# EasyEDA Pro project meteo_station_main.eprj

# Schematic Schematic1
Board Name: Board1; Create Date: 2026-02-01; Page Name: P1; Project Name: meteo_station_main; Schematic Name: Schematic1; Update Date: 2026-02-01; Company: EasyEDA.com; Page Size: A4; Version: V1.0
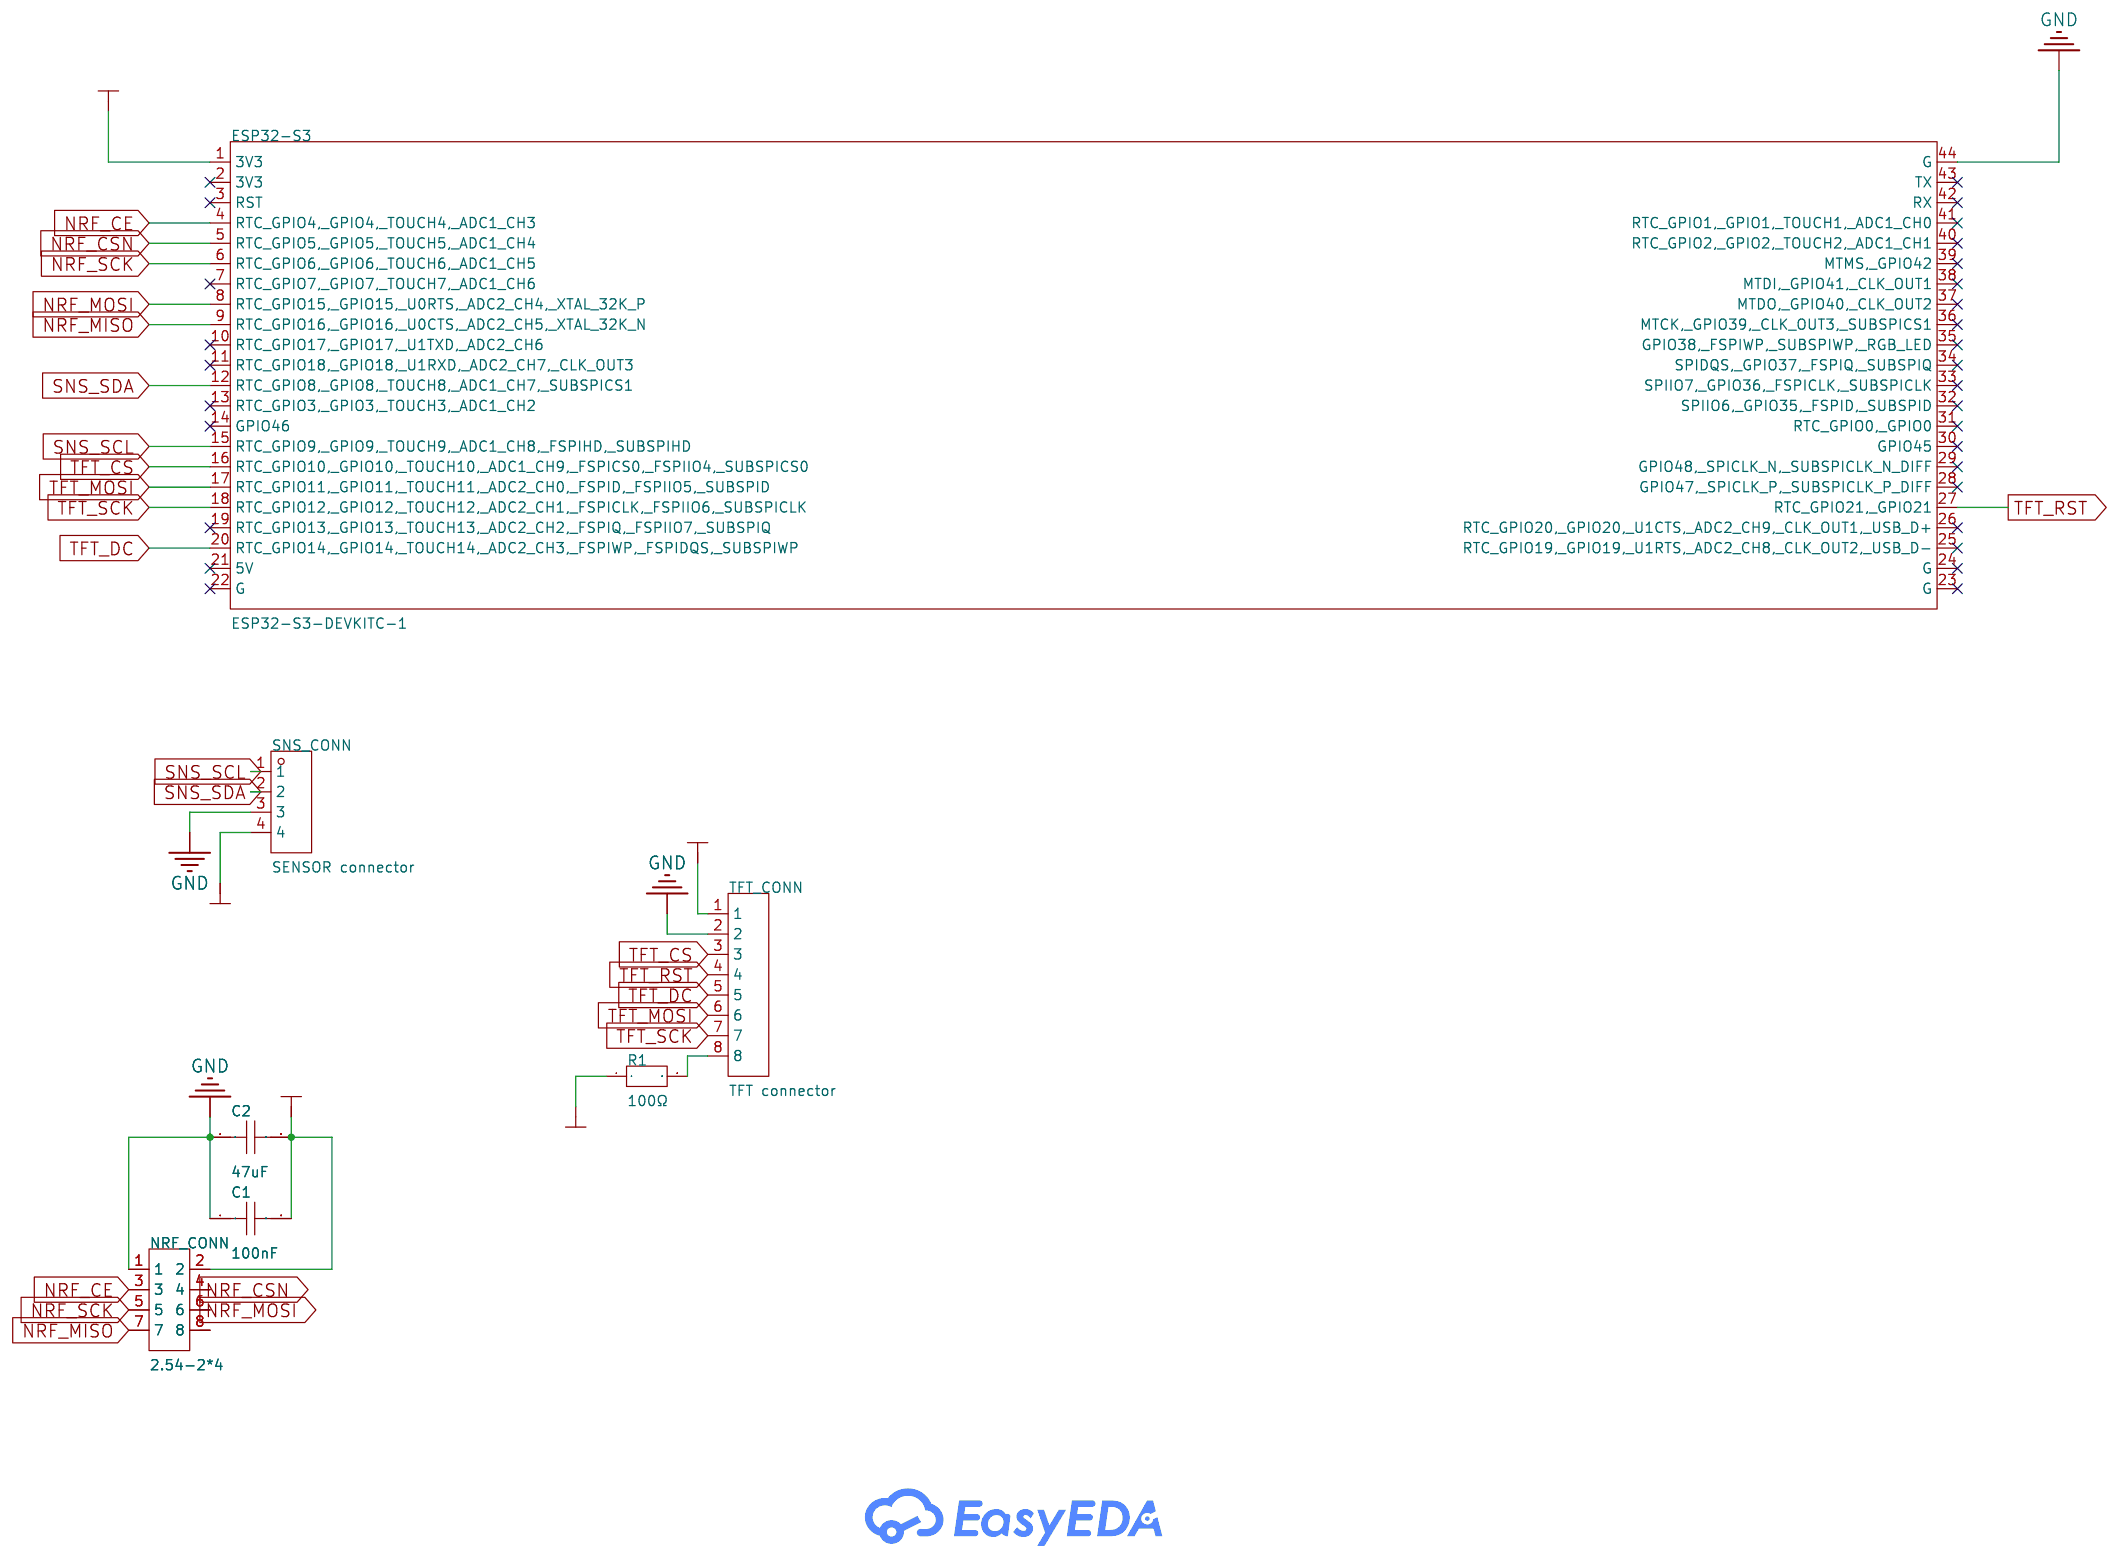
[diagram p0: schematic sheet]

## Parts
C1  100nF  [CAP-TH_L5.5-W2.4-P5.08-D0.6]
C2  47uF  [CAP-TH_L5.5-W2.4-P5.08-D0.6]
ESP32-S3  ESP32-S3-DEVKITC-1  [COMM-TH_ESP32-S3-DEVKITC-N16R8]
NRF_CONN  2.54-2*4  [HDR-TH_8P-P2.54-V-F-R2-C4-S2.54]
R1  100Ω  [RES-TH_BD5.6-L14.0-P18.00-D0.8]
SNS_CONN  SENSOR connector  [HDR-TH_4P-P2.54-V-M-3]
TFT_CONN  TFT connector  [CONN-TH_8P-P2.54_XH2.54_C9900012080]

## Library data of the parts
C1 C2 = CC1H104ZC1ED3F5O1100: Capacitance:100nF Tolerance:-20%~+80% Tolerance:-20%~+80% Voltage Rating:50V Pin Spacing:5.08mm Temperature Coefficient:Y5V Diameter:5.5mm Body Thickness:2.4mm; LCSC Part Name: 100nF -20%~+80% 50V; Supplier Part: C2832507; Manufacturer: Dersonic(德尔创); Supplier Footprint: 插件,P=5.08mm; JLCPCB Part Class: Extended Part; Datasheet: https://item.szlcsc.com/datasheet/CC1H104ZC1ED3F5O1100/2990645.html; Supplier: LCSC; Tolerance: -20%~+80%; Voltage Rating: 50V; Pin Spacing: 5.08mm; Temperature Coefficient: Y5V; Diameter: 5.5mm; Body Thickness: 2.4mm
ESP32-S3 = ESP32-S3-DEVKITC-1-N8: Supplier Part: C20438410; Manufacturer: ESPRESSIF(乐鑫); JLCPCB Part Class: Extended Part; Supplier: LCSC
NRF_CONN = 2.54-2*4: Holes Structure:2x4P Pitch:2.54mm Row Spacing:2.54mm Circular Hole / Square Hole:Square Hole Mounting Type:Through Hole Number of Rows:2 Number of Positions:8P Current Rating:2.5A Voltage Rating (Max):- Holes Direction:Top Insulation Height:8.5mm Operatin; LCSC Part Name: 间距:2.54mm 2x4P 直插; Supplier Part: C2977588; Manufacturer: ZHOURI(洲日); Supplier Footprint: 插件,P=2.54mm; JLCPCB Part Class: Extended Part; Datasheet: https://item.szlcsc.com/datasheet/2.54-2*4/3388940.html; Supplier: LCSC; Holes Structure: 2x4P; Pitch: 2.54mm; Row Spacing: 2.54mm; Circular Hole / Square Hole: Square Hole; Mounting Type: Through Hole; Number of Rows: 2; Number of Positions: 8P; Current Rating: 2.5A; Holes Direction: Top; Insulation Height: 8.5mm; Operating Temperature: -40℃~+105℃
R1 = RLP03100R0FB15: Resistance: Tolerance:±1% Tolerance:±1%; LCSC Part Name: 100Ω ±1%; Supplier Part: C3429629; Manufacturer: VISHAY(威世); JLCPCB Part Class: Extended Part; Supplier: LCSC; Tolerance: ±1%
SNS_CONN = SIP4-CON4排针: Supplier Part: C9900002129; Supplier Footprint: SIP-4_2.54X10.16X2.54P; JLCPCB Part Class: Extended Part; Supplier: LCSC
TFT_CONN = XH2.54-8PIN: Supplier Part: C9900014929; Supplier Footprint: JP8; JLCPCB Part Class: Extended Part; Supplier: LCSC

## Nets
GND: C1.1 C2.1 ESP32-S3.44(G) NRF_CONN.1 SNS_CONN.3 TFT_CONN.2
VCC_3V3: C1.2 C2.2 ESP32-S3.1(3V3) NRF_CONN.2 R1.1 SNS_CONN.4 TFT_CONN.1
NRF_CE: ESP32-S3.4(RTC_GPIO4, GPIO4, TOUCH4, ADC1_CH3) NRF_CONN.3
NRF_CSN: ESP32-S3.5(RTC_GPIO5, GPIO5, TOUCH5, ADC1_CH4) NRF_CONN.4
NRF_MISO: ESP32-S3.9(RTC_GPIO16, GPIO16, U0CTS, ADC2_CH5, XTAL_32K_N) NRF_CONN.7
NRF_MOSI: ESP32-S3.8(RTC_GPIO15, GPIO15, U0RTS, ADC2_CH4, XTAL_32K_P) NRF_CONN.6
NRF_SCK: ESP32-S3.6(RTC_GPIO6, GPIO6, TOUCH6, ADC1_CH5) NRF_CONN.5
SNS_SCL: ESP32-S3.15(RTC_GPIO9, GPIO9, TOUCH9, ADC1_CH8, FSPIHD, SUBSPIHD) SNS_CONN.1
SNS_SDA: ESP32-S3.12(RTC_GPIO8, GPIO8, TOUCH8, ADC1_CH7, SUBSPICS1) SNS_CONN.2
TFT_CS: ESP32-S3.16(RTC_GPIO10, GPIO10, TOUCH10, ADC1_CH9, FSPICS0, FSPIIO4, SUBSPICS0) TFT_CONN.3
TFT_DC: ESP32-S3.20(RTC_GPIO14, GPIO14, TOUCH14, ADC2_CH3, FSPIWP, FSPIDQS, SUBSPIWP) TFT_CONN.5
TFT_MOSI: ESP32-S3.17(RTC_GPIO11, GPIO11, TOUCH11, ADC2_CH0, FSPID, FSPIIO5, SUBSPID) TFT_CONN.6
TFT_RST: ESP32-S3.27(RTC_GPIO21, GPIO21) TFT_CONN.4
TFT_SCK: ESP32-S3.18(RTC_GPIO12, GPIO12, TOUCH12, ADC2_CH1, FSPICLK, FSPIIO6, SUBSPICLK) TFT_CONN.7
$1N883: R1.2 TFT_CONN.8

Not connected (* = marked no-connect by the designer): ESP32-S3 2(3V3)* 3(RST)* 7(RTC_GPIO7, GPIO7, TOUCH7, ADC1_CH6)* 10(RTC_GPIO17, GPIO17, U1TXD, ADC2_CH6)* 11(RTC_GPIO18, GPIO18, U1RXD, ADC2_CH7, CLK_OUT3)* 13(RTC_GPIO3, GPIO3, TOUCH3, ADC1_CH2)* 14(GPIO46)* 19(RTC_GPIO13, GPIO13, TOUCH13, ADC2_CH2, FSPIQ, FSPIIO7, SUBSPIQ)* 21(5V)* 22(G)* 23(G)* 24(G)* 25(RTC_GPIO19, GPIO19, U1RTS, ADC2_CH8, CLK_OUT2, USB_D-)* 26(RTC_GPIO20, GPIO20, U1CTS, ADC2_CH9, CLK_OUT1, USB_D+)* 28(GPIO47, SPICLK_P, SUBSPICLK_P_DIFF)* 29(GPIO48, SPICLK_N, SUBSPICLK_N_DIFF)* 30(GPIO45)* 31(RTC_GPIO0, GPIO0)* 32(SPIIO6, GPIO35, FSPID, SUBSPID)* 33(SPIIO7, GPIO36, FSPICLK, SUBSPICLK)* 34(SPIDQS, GPIO37, FSPIQ, SUBSPIQ)* 35(GPIO38, FSPIWP, SUBSPIWP, RGB LED)* 36(MTCK, GPIO39, CLK_OUT3, SUBSPICS1)* 37(MTDO, GPIO40, CLK_OUT2)* 38(MTDI, GPIO41, CLK_OUT1)* 39(MTMS, GPIO42)* 40(RTC_GPIO2, GPIO2, TOUCH2, ADC1_CH1)* 41(RTC_GPIO1, GPIO1, TOUCH1, ADC1_CH0)* 42(RX)* 43(TX)*; NRF_CONN 8

# Board PCB1
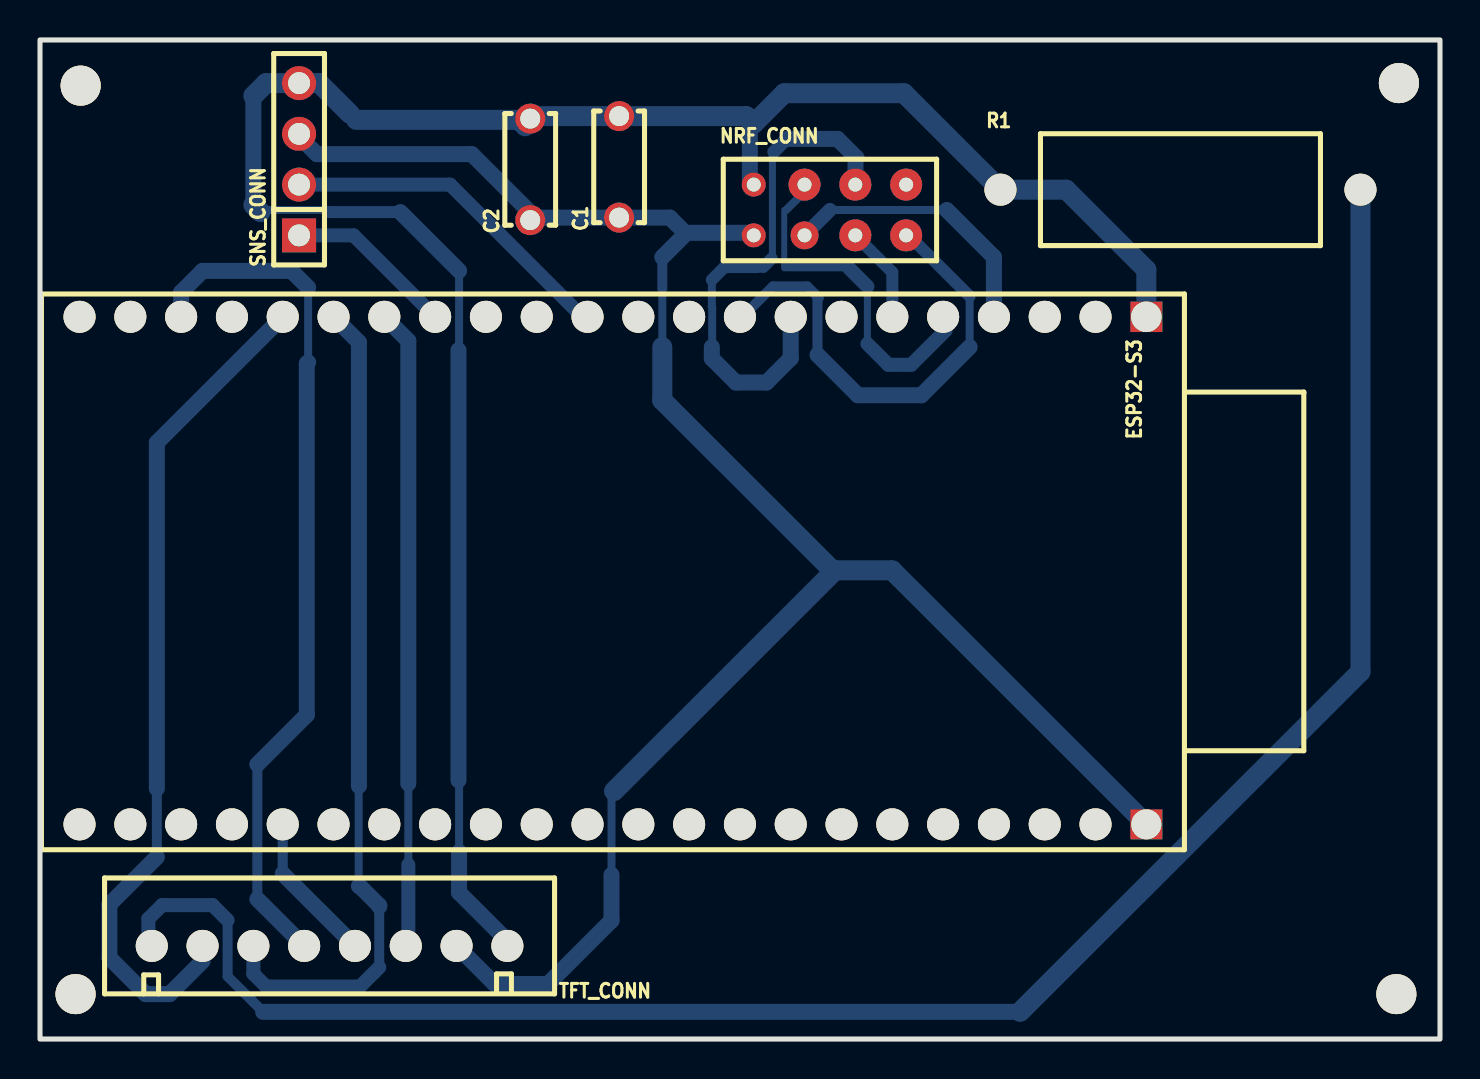
[diagram p1: board, top side]
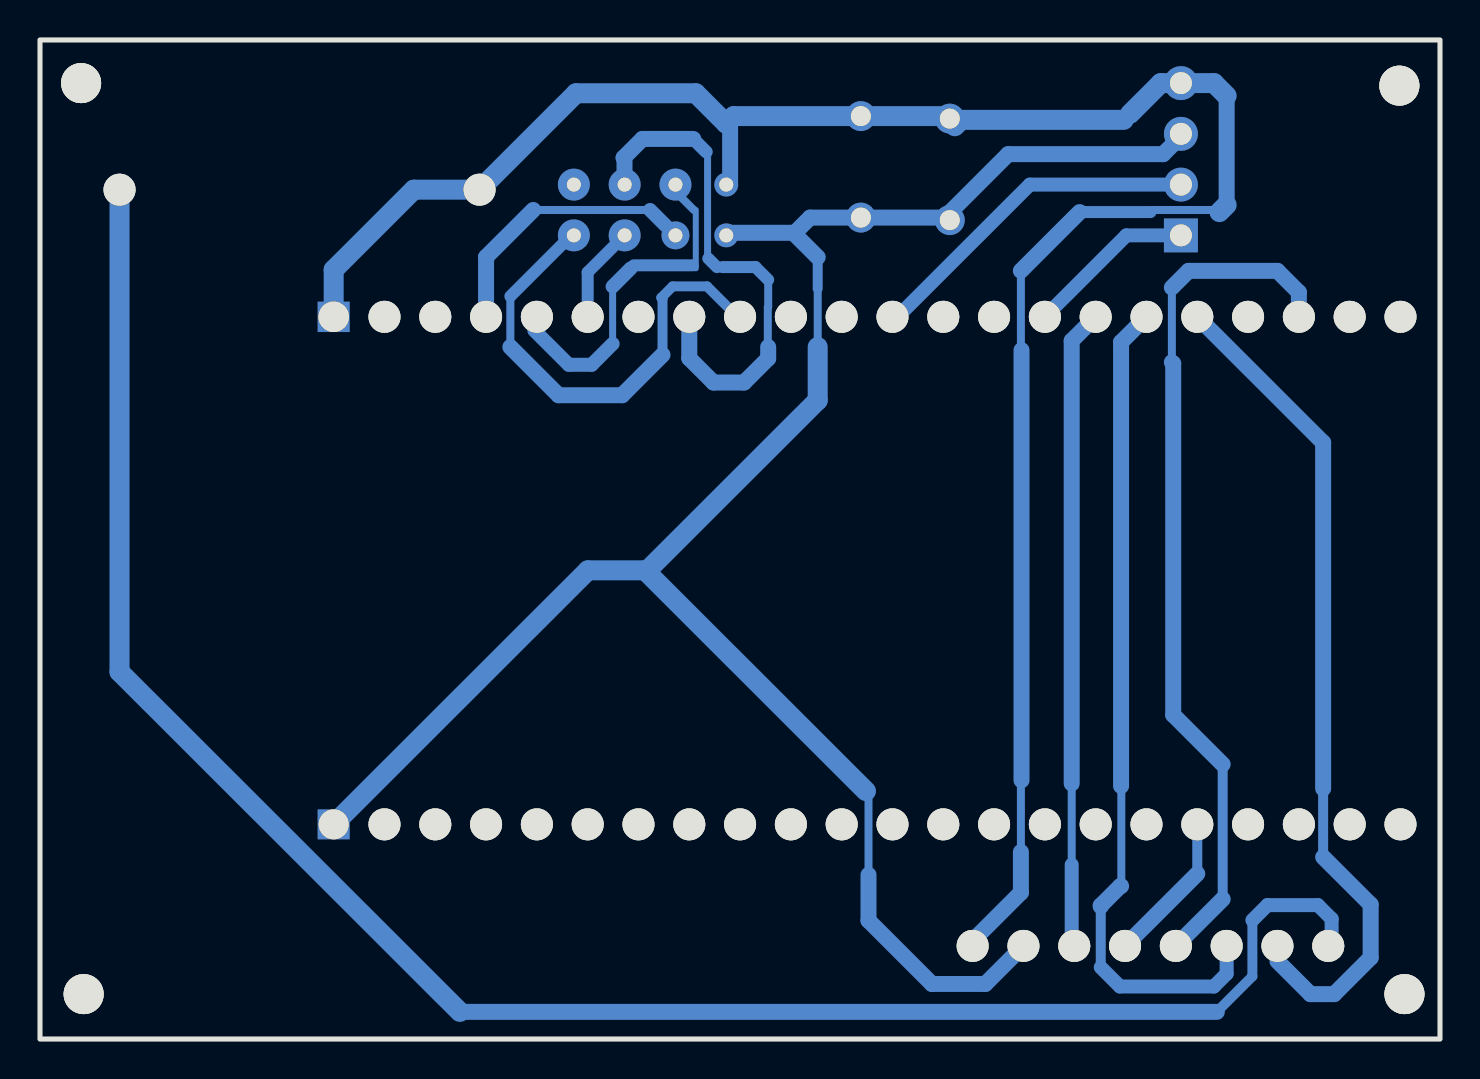
[diagram p2: board, bottom side, seen from below]

Outline 70 x 50 mm; copper layers: Top Layer, Bottom Layer. Coordinates in mm from the lower left corner of the outline.
Outline path: rectangle 0,50 70,0
Stack: Top Layer 0.035mm / Dielectric1 1.51mm FR4 er 4.5 / Bottom Layer 0.035mm

## Design rules (mm)
template: JLCPCB Capability(Two Layers Board)
spacing copperThickness1oz (default): track to track 0.102, other pairs 0.152 to 0.3
spacing copperThickness2oz: track to track 0.203, other pairs 0.152 to 0.3
track width copperThickness1oz (default): min 0.127, default 0.254, max 2.54
track width copperThickness2oz: min 0.203, default 0.254, max 2.54
differential pair differentialPair (default): width min 0.127, default 0.254, max 2.54; gap min 0.152, default 0.152
via viaSize (default): diameter min 0.5, default 0.61, max 10; hole min 0.3, default 0.305, max 6.3

## Placement (name value [footprint] x y rotation side)
C1  100nF  [CAP-TH_L5.5-W2.4-P5.08-D0.6]  28.96 43.65 90 top
C2  47uF  [CAP-TH_L5.5-W2.4-P5.08-D0.6]  24.51 43.52 90 top
ESP32-S3  ESP32-S3-DEVKITC-1  [COMM-TH_ESP32-S3-DEVKITC-N16R8]  28.65 23.44 270 top
NOREF  -  [Pad_e24]  67.82 2.25 0 top
NOREF#2  -  [Pad_e8608]  67.95 47.84 0 top
NOREF#3  -  [Pad_e439]  1.78 2.25 0 top
NOREF#4  -  [Pad_e19]  2.03 47.71 0 top
NRF_CONN  2.54-2*4  [HDR-TH_8P-P2.54-V-F-R2-C4-S2.54]  39.5 41.49 0 top
R1  100Ω  [RES-TH_BD5.6-L14.0-P18.00-D0.8]  57.02 42.51 0 top
SNS_CONN  SENSOR connector  [HDR-TH_4P-P2.54-V-M-3]  12.95 44.03 90 top
TFT_CONN  TFT connector  [CONN-TH_8P-P2.54_XH2.54_C9900012080]  14.48 4.66 180 top

## Footprints (pads in the part's own frame, mm; a bottom-side part is the same pattern mirrored in y, then rotated)
CAP-TH_L5.5-W2.4-P5.08-D0.6
  round 1.5 hole 1x0.8: 1(-2.54,0) 2(2.54,0)
COMM-TH_ESP32-S3-DEVKITC-N16R8
  rect 1.524x1.6 hole 1.6x0.8: 1(-12.7,26.67)
  round 1.6 hole 1.6x0.8: 2(-12.7,24.13) 3(-12.7,21.59) 4(-12.7,19.05) 5(-12.7,16.51) 6(-12.7,13.97) 7(-12.7,11.43) 8(-12.7,8.89) 9(-12.7,6.35) 10(-12.7,3.81) 11(-12.7,1.27) 12(-12.7,-1.27) 13(-12.7,-3.81) 14(-12.7,-6.35) 15(-12.7,-8.89) 16(-12.7,-11.43) 17(-12.7,-13.97) 18(-12.7,-16.51) 19(-12.7,-19.05) 20(-12.7,-21.59) 21(-12.7,-24.13) 22(-12.7,-26.67) 23(12.7,-26.67) 24(12.7,-24.13) 25(12.7,-21.59) 26(12.7,-19.05) 27(12.7,-16.51) 28(12.7,-13.97) 29(12.7,-11.43) 30(12.7,-8.89) 31(12.7,-6.35) 32(12.7,-3.81) 33(12.7,-1.27) 34(12.7,1.27) 35(12.7,3.81) 36(12.7,6.35) 37(12.7,8.89) 38(12.7,11.43) 39(12.7,13.97) 40(12.7,16.51) 41(12.7,19.05) 42(12.7,21.59) 43(12.7,24.13)
  rect 1.5x1.6 hole 1.6x0.8: 44(12.7,26.67)
CONN-TH_8P-P2.54_XH2.54_C9900012080
  round 1.6 hole 1.6x0.8: 1(-8.89,0) 2(-6.35,0) 3(-3.81,0) 4(-1.27,0) 5(1.27,0) 6(3.81,0) 7(6.35,0) 8(8.89,0)
HDR-TH_4P-P2.54-V-M-3
  rect 1.7x1.7 hole 1.1x0.8: 1(-3.81,0)
  round 1.7 hole 1.1x0.8: 2(-1.27,0) 3(1.27,0) 4(3.81,0)
HDR-TH_8P-P2.54-V-F-R2-C4-S2.54
  round 1.2 hole 0.7: 1(-3.81,-1.27) 2(-3.81,1.27)
  round 1.4 hole 0.7: 3(-1.27,-1.27)
  round 1.6 hole 0.7: 4(-1.27,1.27) 5(1.27,-1.27) 6(1.27,1.27) 7(3.81,-1.27) 8(3.81,1.27)
Pad_e19
  round 2 hole 4x2: 1(0,0)
Pad_e24
  round 2 hole 4x2: 2(0,0)
Pad_e439
  round 2 hole 4x2: 2(0,0)
Pad_e8608
  round 2 hole 4x2: 2(0,0)
RES-TH_BD5.6-L14.0-P18.00-D0.8
  round 1.6 hole 1.6x0.8: 1(-9,0) 2(9,0)

## Nets
As in the schematic.

Pads without a net: ESP32-S3 2 3 7 10 11 13 14 19 21 22 23 24 25 26 28 29 30 31 32 33 34 35 36 37 38 39 40 41 42 43; NOREF 2; NOREF#2 2; NOREF#3 2; NOREF#4 1

## Routing (per net, layer and track width the routed paths; a pad name or vN(x,y) marks a point on that pad's centre or on a via; arc(x,y) is an arc through that point)
GND: length 98.7
  Bottom Layer w0.4: 31.11,37.55 31.11,34.63 ; 28.58,8.22 28.58,12.28
  Bottom Layer w0.5: 31.11,39.13 31.11,37.55
  Bottom Layer w0.8: SNS_CONN.3 12.95,45.17 13.84,44.28 21.59,44.28 24.51,41.36 C2.1 24.64,41.11 C1.1 31.5,41.11 32.26,40.35 ; 28.58,8.22 28.58,5.93 25.4,2.76 22.73,2.76 TFT_CONN.2 ; 31.11,39.13 32.33,40.35 35.56,40.35 NRF_CONN.1
  Bottom Layer w1: ESP32-S3.44 42.6,23.46 39.75,23.46 28.7,12.41 ; 31.11,34.63 31.11,31.97 39.62,23.46
VCC_3V3: length 107.7
  Bottom Layer w0.4: 20.95,12.92 20.95,9.36 ; 14.48,41.39 14.37,41.49 11.13,41.49 11.03,41.39 ; 20.95,38.45 20.95,34.51
  Bottom Layer w0.5: 35.49,42.95 35.69,42.76 ; 20.92,12.95 20.95,12.92 ; 35.69,45.81 35.49,45.61 ; 20.95,34.51 20.92,34.48
  Bottom Layer w0.6: 14.48,41.39 18.02,41.39
  Bottom Layer w0.7: 23.37,4.91 TFT_CONN.1
  Bottom Layer w0.8: 10.67,47.21 10.67,41.74 ; 35.49,45.61 35.49,42.95 ; 20.92,34.48 20.92,12.95 ; 20.95,38.45 18.02,41.39 ; 20.95,9.36 20.95,7.33 23.37,4.91 ; 24.51,46.06 24.51,45.94 24.26,45.68
  Bottom Layer w1: 24.26,45.68 23.94,46 15.81,46 ; 10.67,41.74 11.03,41.39 ; 24.51,46.06 24.64,46.19 C1.2 35.31,46.19 35.69,45.81 37.21,47.33 43.2,47.33 R1.1 51.31,42.51 55.32,38.5 ESP32-S3.1 ; 15.49,46.31 13.96,47.84 SNS_CONN.4 11.3,47.84 10.67,47.21
NRF_CE: length 14
  Bottom Layer w0.4: 45.34,41.49 39.5,41.49
  Bottom Layer w0.7: 39.5,41.49 NRF_CONN.3
  Bottom Layer w0.8: 45.34,41.49 47.7,39.13 ESP32-S3.4
NRF_CSN: length 17.5
  Bottom Layer w0.3: 37.21,38.57 37.21,41.49
  Bottom Layer w0.35: ESP32-S3.5 45.28,36.02 45.28,35.47 ; 38.23,42.51 38.23,42.76 ; 41.37,34.79 41.37,37.66
  Bottom Layer w0.4: 37.31,41.49 38.23,42.41 38.23,42.51
  Bottom Layer w0.6: 40.31,38.72 37.36,38.72
  Bottom Layer w0.7: 41.37,37.66 40.46,38.57 ; 41.37,34.79 42.42,33.74 43.56,33.74 45.28,35.47
NRF_MISO: length 24.1
  Bottom Layer w0.4: 46.48,37.17 46.48,34.63
  Bottom Layer w0.5: NRF_CONN.7 43.43,40.22 ; 38.87,34.24 38.87,37.04 38.93,37.1 38.37,37.67 36.65,37.67 35.12,36.14 ESP32-S3.9
  Bottom Layer w0.6: 43.43,40.22 46.48,37.17
  Bottom Layer w0.8: 46.48,34.63 44.07,32.22 40.89,32.22 38.87,34.24
NRF_MOSI: length 26
  Bottom Layer w0.35: 36.62,44.33 36.62,39
  Bottom Layer w0.4: 33.59,38 33.59,36.64 33.61,36.62 33.61,34.65 33.59,34.63 ; 36.15,38.63 35.88,38.63
  Bottom Layer w0.5: 40.82,42.94 40.77,42.89 40.77,42.76
  Bottom Layer w0.6: 36.58,39.06 36.15,38.63 ; 33.59,38 34.23,38.63 35.88,38.63
  Bottom Layer w0.65: 37.34,45.05 36.69,44.4
  Bottom Layer w0.8: ESP32-S3.8 37.54,34.07 36.32,32.85 34.8,32.85 33.59,34.06 33.59,34.63 ; 40.82,42.94 40.77,42.99 40.77,44.11 40.82,44.11 39.88,45.05 37.34,45.05
NRF_SCK: length 4.8
  Bottom Layer w0.6: NRF_CONN.5 42.62,38.37 ESP32-S3.6
SNS_SCL: length 8.5
  Bottom Layer w0.7: SNS_CONN.1 15.68,40.22 ESP32-S3.15
SNS_SDA: length 17.2
  Bottom Layer w0.7: ESP32-S3.12 27.12,36.14 20.51,42.76 SNS_CONN.2
TFT_CS: length 32
  Bottom Layer w0.4: 18.42,8.72 18.42,12.79
  Bottom Layer w0.7: 18.42,8.72 18.42,4.79 TFT_CONN.3
  Bottom Layer w0.8: 18.42,12.79 18.42,34.95 ESP32-S3.16
TFT_DC: length 43.3
  Bottom Layer w0.4: 13.41,37.61 13.41,33.87
  Bottom Layer w0.5: 10.87,13.75 10.87,7
  Bottom Layer w0.8: 10.87,13.75 13.34,16.22 13.34,33.8 13.41,33.87 ; 10.87,7 TFT_CONN.5 ; ESP32-S3.20 7.06,37.37 8.13,38.44 12.57,38.44 13.41,37.61
TFT_MOSI: length 41.9
  Bottom Layer w0.4: 15.93,7.67 15.93,12.65 15.95,12.66
  Bottom Layer w0.5: 16.96,3.59 16.96,6.64
  Bottom Layer w0.7: 16.96,3.59 16,2.63 11.31,2.63 10.67,3.27 TFT_CONN.6
  Bottom Layer w0.8: ESP32-S3.17 15.95,34.87 15.95,12.66 ; 15.95,7.65 15.99,7.65 16.96,6.68 16.96,6.64
TFT_RST: length 7.6
  Bottom Layer w0.5: ESP32-S3.27 12.14,8.27
  Bottom Layer w0.8: 12.14,8.27 TFT_CONN.4
TFT_SCK: length 42.5
  Bottom Layer w0.5: 5.84,9.11 5.84,12.53 ; TFT_CONN.7 8.13,3.9
  Bottom Layer w0.8: 5.84,12.53 5.84,29.85 ESP32-S3.18 ; 8.13,3.9 6.48,2.25 5.29,2.25 3.47,4.07 3.47,6.73 5.84,9.11
$1N883: length 97.4
  Bottom Layer w0.5: 5.42,5.08 5.59,4.91 TFT_CONN.8 ; 11.16,1.36 9.38,3.14 9.38,5.95
  Bottom Layer w0.7: 5.42,5.08 5.42,6.02 6.11,6.7 8.63,6.7 9.38,5.95
  Bottom Layer w0.8: 11.16,1.36 49.01,1.36
  Bottom Layer w1: 49.01,1.36 66.02,18.38 R1.2
